# EAGLE design dc-dc_24V_5A_0_2 (EAGLE 6.1)
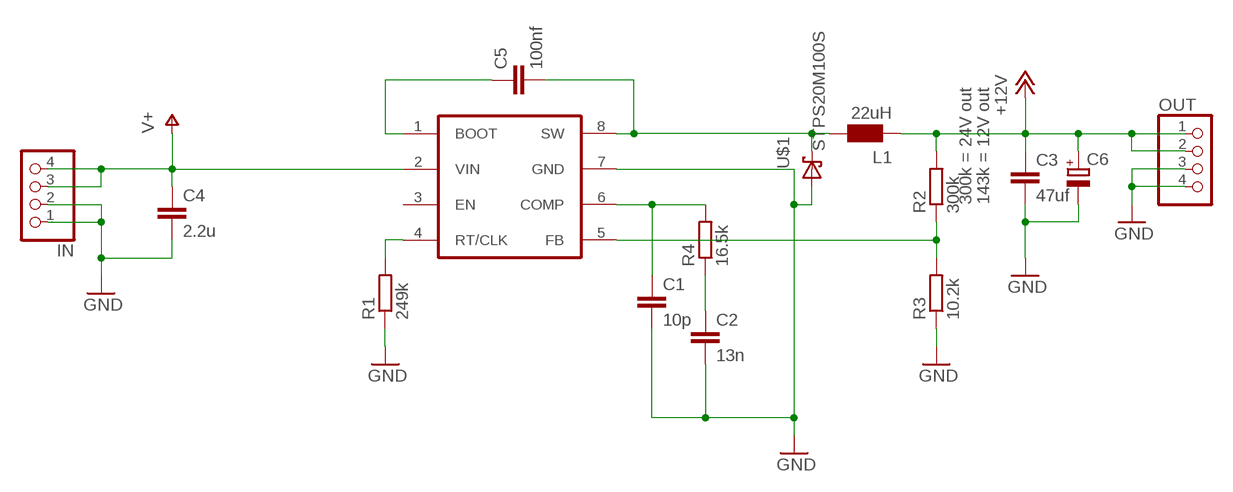
[diagram p0: schematic, sheet 1]

## Parts
C1  10p  C-EUC0805  [C0805]
C2  13n  C-EUC1206  [C1206]
C3  47uf  C-EUC1210  [C1210]
C4  2.2u  C-EUC1210  [C1210]
C5  100nf  C-EUC0805  [C0805]
C6  CPOL-EUE2.5-5  [E2,5-5]
IN  PINHD-1X4  [1X04]
L1  22uH  WE-PD_L/XL/XXL  [WE-PD_L/XL/XXL]
OUT  PINHD-1X4  [1X04]
R1  249k  R-EU_R0805  [R0805]
R2  300k  R-EU_R0805  [R0805]
R3  10.2k  R-EU_R0805  [R0805]
R4  16.5k  R-EU_R0805  [R0805]
U1  TPS54560  [SO08-POWERPAD]
U$1  STPS20M100S  [D2PACK]

## Nets
+12V: C3.1 C6.+ L1.2 OUT.1 OUT.2 R2.2
GND: C1.2 C2.2 C3.2 C4.2 C6.- IN.1 IN.2 OUT.3 OUT.4 R1.1 R3.1 U1.7(GND) U$1.1(A) U$1.3(A)
N$1: C5.1 U1.1(BOOT)
N$2: C5.2 L1.1 U1.8(SW) U$1.2(K)
N$4: R2.1 R3.2 U1.5(FB)
N$5: C1.1 R4.2 U1.6(COMP)
N$6: C2.1 R4.1
N$8: R1.2 U1.4(RT/CLK)
V+: C4.1 IN.3 IN.4 U1.2(VIN)
Unconnected: U1.3(EN)

## Notes on the sheet
- 300k = 24V out | 143k = 12V out

## Library data of the parts
C1-C5 = rcl:C-EU: CAPACITOR, European symbol
C6 = rcl:CPOL-EU: POLARIZED CAPACITOR, European symbol
IN OUT = pinhead:PINHD-1X4: PIN HEADER
L1 = wuerth-elektronik:WE-PD: SMD-Shielded Power Inductors WE-PD Is recommended for the application with switching regulators from National Semiconductor, Linear Technology, Texas Instruments and Fairchild Semiconductor - Magnetically shielded version which results in a low leakage field - High storage capacity - Low self-losses -- Switching regulators with low operating voltages (computer, laptop, mobile phones, pagers) -- Integrated DC/DC-converter
R1-R4 = rcl:R-EU_: RESISTOR, European symbol
U1 = TPS54560:TPS54560
U$1 = STPS20M100S:STPS20M100S: STPS20M100S - Power shottky diode

## Board
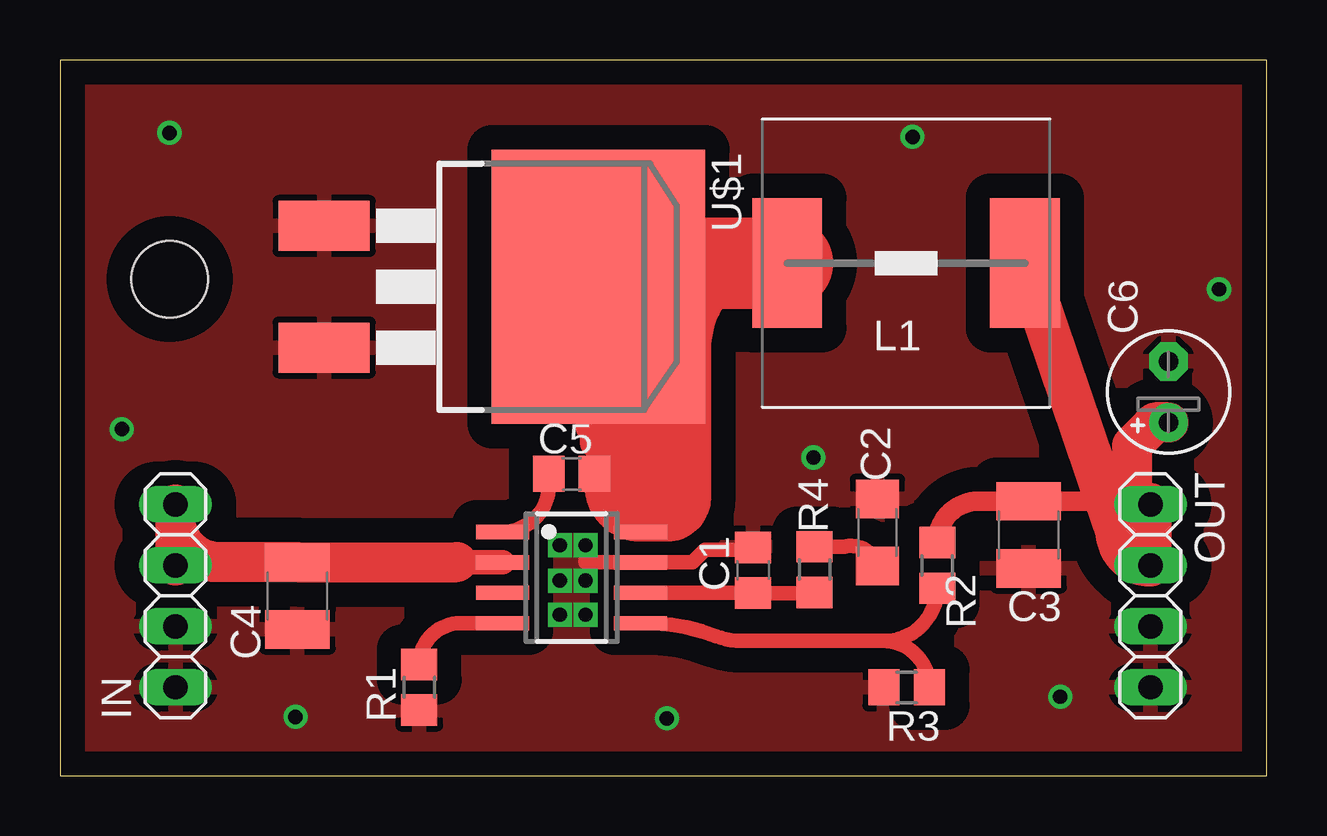
[diagram p1: board, top side]
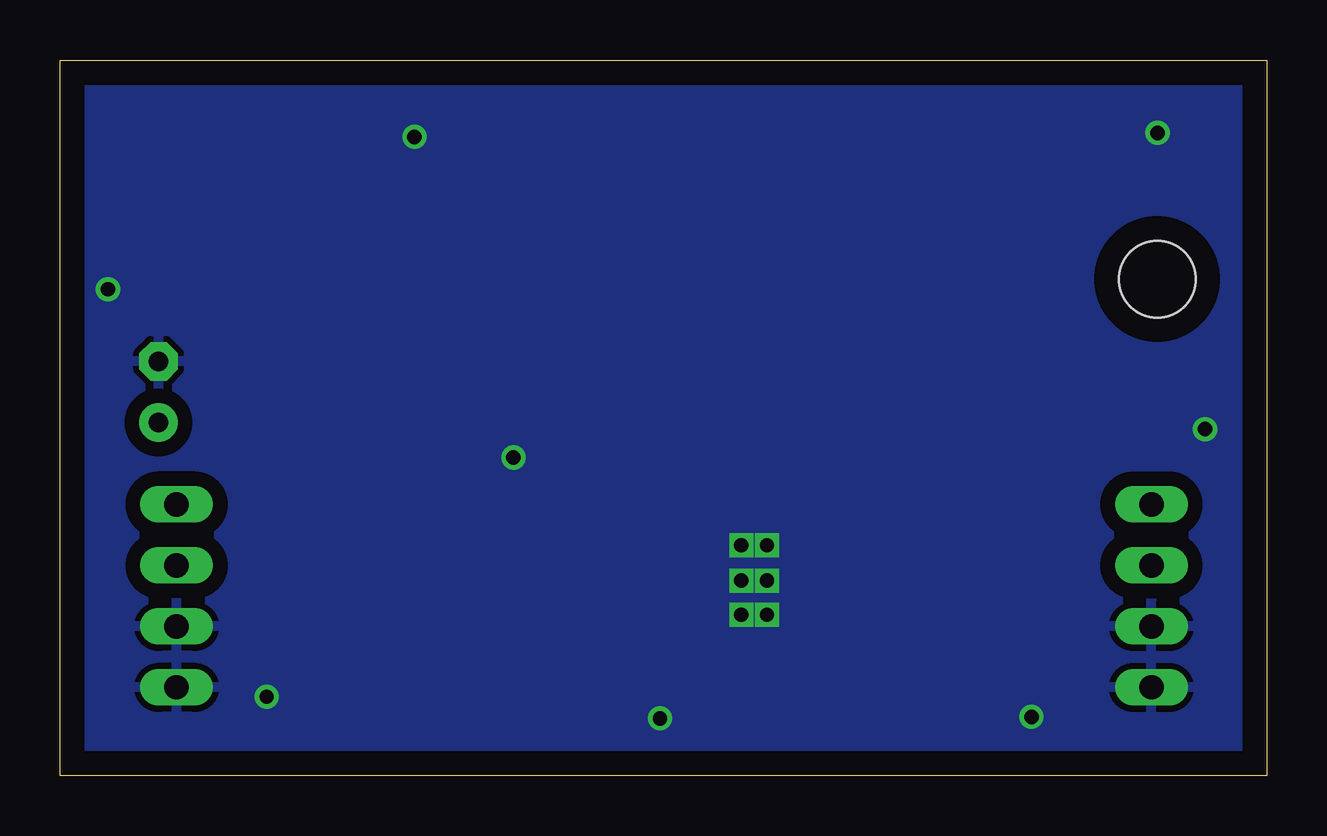
[diagram p2: board, bottom side, seen from below]

Size 50.31 x 29.82 mm. Coordinates in mm from the lower left corner, seen from the top.
Outline: 0,0 50.31,0 50.31,29.82 0,29.82 0,0
Copper layers (1*16): Top 0.035mm / dielectric 1.5mm / Bottom 0.035mm
Design rules: minimum track width 10mil, minimum drill 0.6mm, track to track 8mil, track to pad 8mil, pad to pad 8mil, via to via 8mil, smd to smd 8mil, copper to edge 40mil, drill to drill 8mil, minimum pad ring 10mil, minimum via ring 8mil, stop-mask expansion 4mil, vias tented up to drill 0mil, thermal gap 10mil
Holes 3.2 mm at 4.57,20.69

### Footprints (pad centres in the part's own frame; a part is rotated, then mirrored left to right if it is on the bottom)
C0805 = smd 1.3 x 1.5: 1 -0.95,0; 2 0.95,0
C1206 = smd 1.6 x 1.8: 1 -1.4,0; 2 1.4,0
C1210 = smd 1.6 x 2.7: 1 -1.4,0; 2 1.4,0
E2,5-5 = drill 0.813 pad 1.6: + -1.27,0 | drill 0.813 pad 1.6 octagon: - 1.27,0
1X04 = drill 1.016 long: 1 -3.81,0; 2 -1.27,0; 3 1.27,0; 4 3.81,0
WE-PD_L/XL/XXL = smd 2.9 x 5.4: 1 -4.95,0; 2 4.95,0
R0805 = smd 1.3 x 1.5: 1 -0.95,0; 2 0.95,0
SO08-POWERPAD = smd 0.6 x 2.2: 1 -1.905,-2.875; 2 -0.635,-2.875; 3 0.635,-2.875; 4 1.905,-2.875; 5 1.905,2.875; 6 0.635,2.875; 7 -0.635,2.875; 8 -1.905,2.875
D2PACK = smd 2.083 x 3.81: 1 -2.54,-10.16; 3 2.54,-10.16 | smd 11.43 x 8.89: 2 0,1.27

### Placement (x,y rotation side)
C1  28.89,8.56 90 top
C2  34.07,10.13 90 top
C3  40.37,10.03 270 top
C4  9.89,7.49 270 top
C5  21.32,12.57 0 top
C6  46.2,15.99 90 top
IN  4.81,7.49 90 top
L1  35.27,21.36 0 top
OUT  45.45,7.49 270 top
R1  14.97,3.68 90 top
R2  36.56,8.76 90 top
R3  35.29,3.68 0 top
R4  31.46,8.59 270 top
U1  21.32,8.25 270 top
U$1  21.17,20.37 270 top

### Tracks (layer width: path | path; a pad name or v marks a point on that pad's centre or on a via)
+12V
  Top 0.813: R2.2 arc-90 38.28,11.43 C3.1 42.78,11.43 arc-90 OUT.2
  Top 1.676: C6.+ 45.64,14.72 45.21,14.29 44.68,13.75 44.68,11.42 44.79,11.3 OUT.1
  Top 1.778: OUT.1 OUT.2 arc-90 44.05,10.16 L1.2
GND  (via drill 0.6)
  Top 0.61: v21.91,9.6 21.91,8.89 U1.7 26.37,8.89 26.89,9.41 28.79,9.41 C1.2
  other vias: 20.84,6.71 20.84,9.6 21.91,8.13 20.84,8.13 21.91,6.71 4.56,26.78 35.53,26.62 31.41,13.26 25.3,2.39 9.82,2.45 2.58,14.44 48.31,20.27 41.69,3.29
  pour Bottom (isolate 0.61): -0.27,37.97 50.53,37.97 50.53,-2.67 -0.27,-2.67
  pour Top (isolate 1.016): -1.54,39.24 51.8,39.24 51.8,-3.94 -1.54,-3.94
N$1
  Top 0.61: U1.1 arc90 20.37,12.08 C5.1
N$2
  Top 0.813: L1.1 arc90 26.73,17.78 26.73,11.6 arc-90 25.3,10.16 U1.8 arc-90 22.27,12.08 C5.2
  Top 3.81: L1.1 22.44,21.36 U$1.2
N$3
  Top 1.422: 23.42,10.87 25.35,10.87 25.87,11.39 25.87,14.21 25.59,14.49 23.74,14.49 22.71,13.46 22.71,12.24 23.19,11.76 24.36,11.76 24.85,12.25 24.85,13.14 24.51,13.49 24.31,13.49 23.66,12.84
N$4
  Top 0.61: 34.31,5.61 arc-90 R3.2 | 34.31,5.61 34.36,5.61 arc90 R2.1 | 34.31,5.61 28.41,5.61 arc-22 27.34,5.82 arc24 U1.5
N$5
  Top 0.61: U1.6 C1.1 arc-90 C1.1 31.43,7.61 arc90 R4.2
N$6
  Top 0.61: R4.1 32.69,9.54 arc-90 C2.1
N$7
  Top 1.422: 22.38,13.91 22.38,14.38 22.19,14.57
N$8
  Top 0.61: U1.4 16.69,6.35 arc90 R1.2
V+
  Top 0.406: U1.2
  Top 1.016: 16.55,8.89 U1.2
  Top 1.676: IN.3 4.81,10.67 | 4.81,10.67 IN.4 | 4.81,10.67 arc90 6.72,8.89 C4.1 16.55,8.89